# Altium project TMDX654GPEVM.PrjPcb (part 21 of 24)

## Sheet 42-PERIPHERAL POWER SUPPLY.SchDoc
size 513 x 386 mm
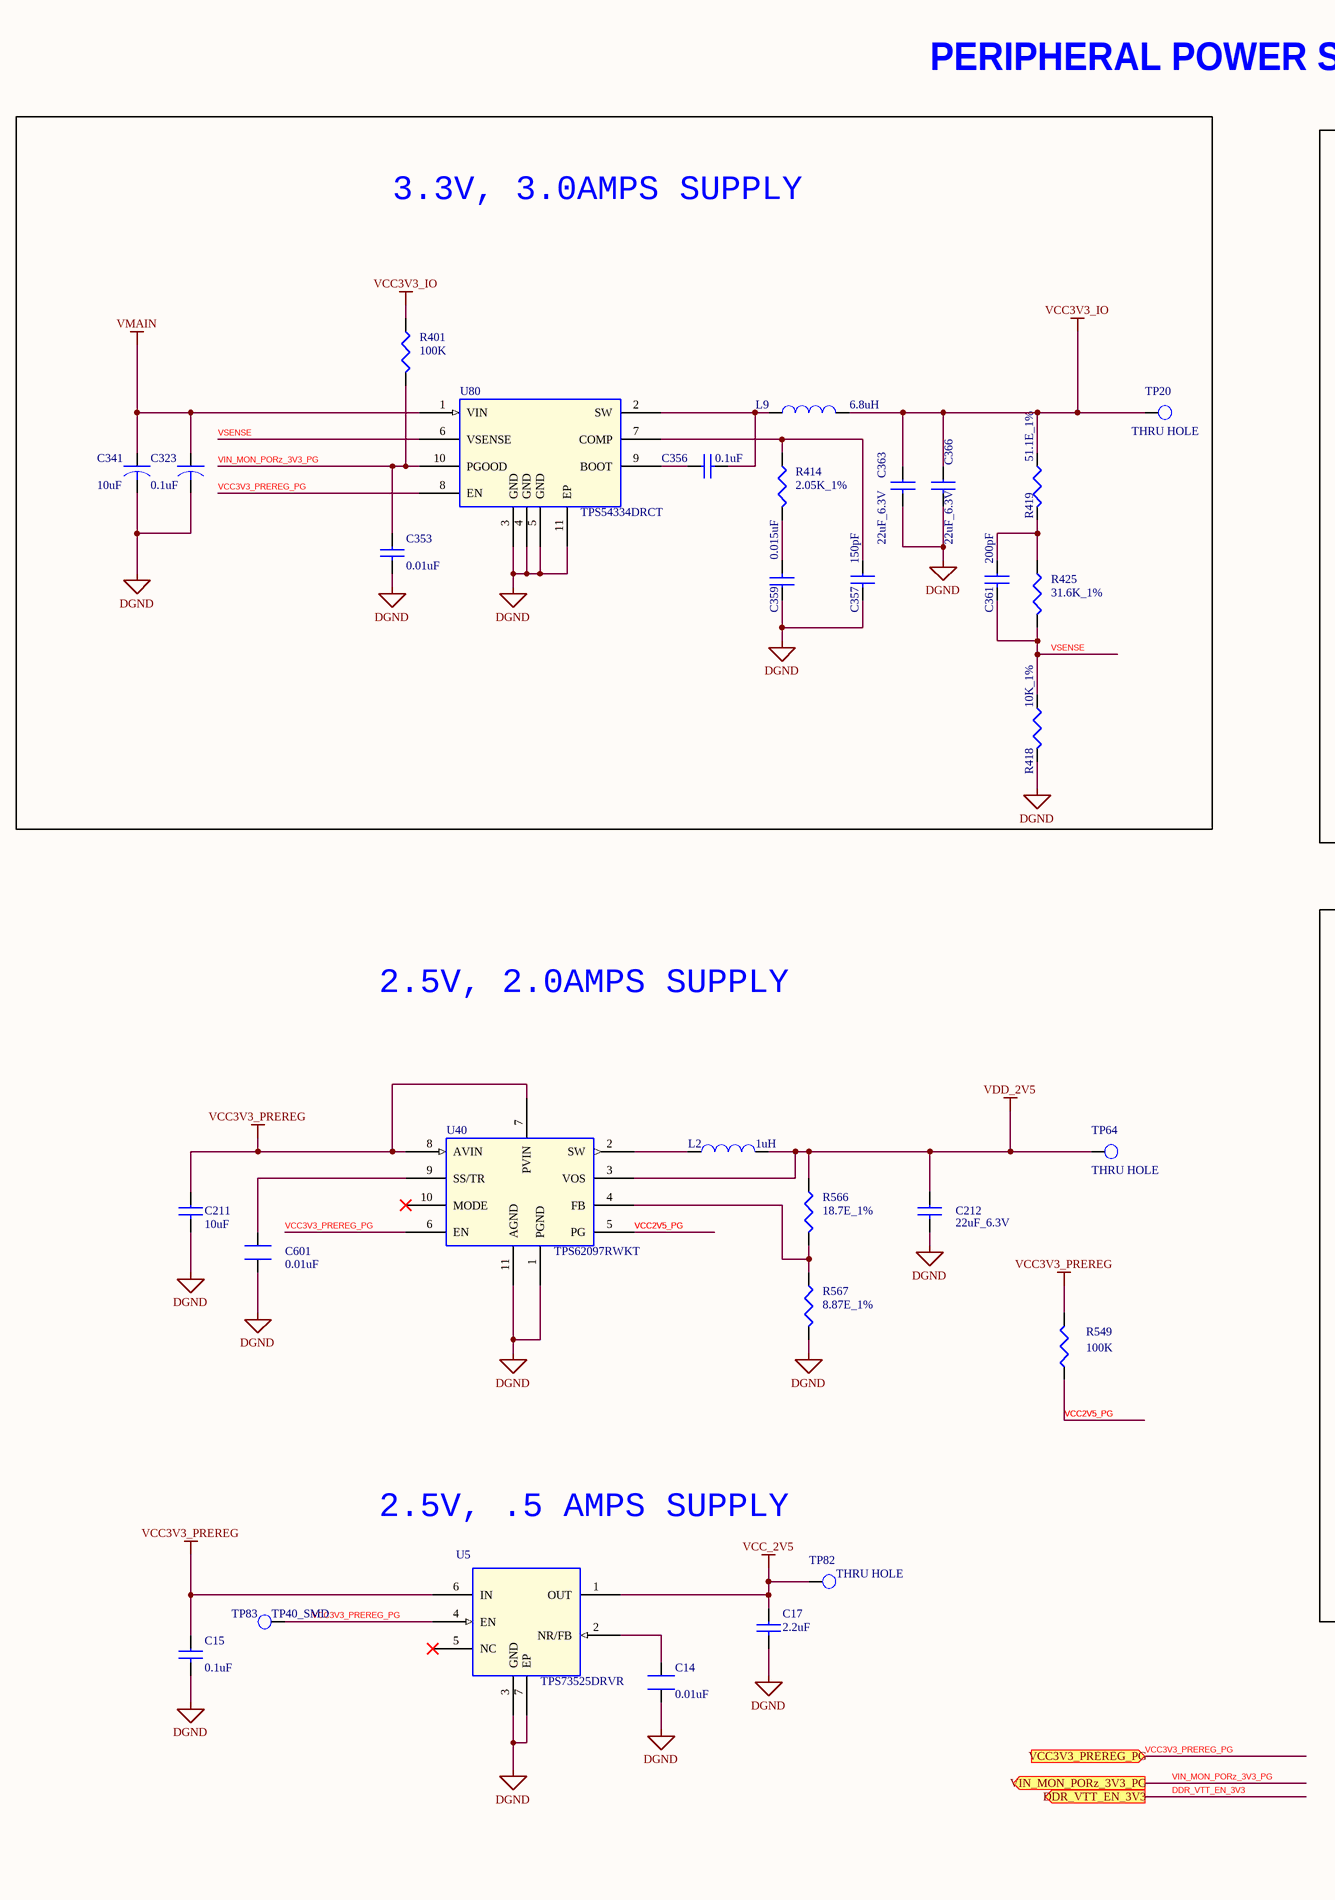
[diagram p78: 42-PERIPHERAL POWER SUPPLY.SchDoc, left]
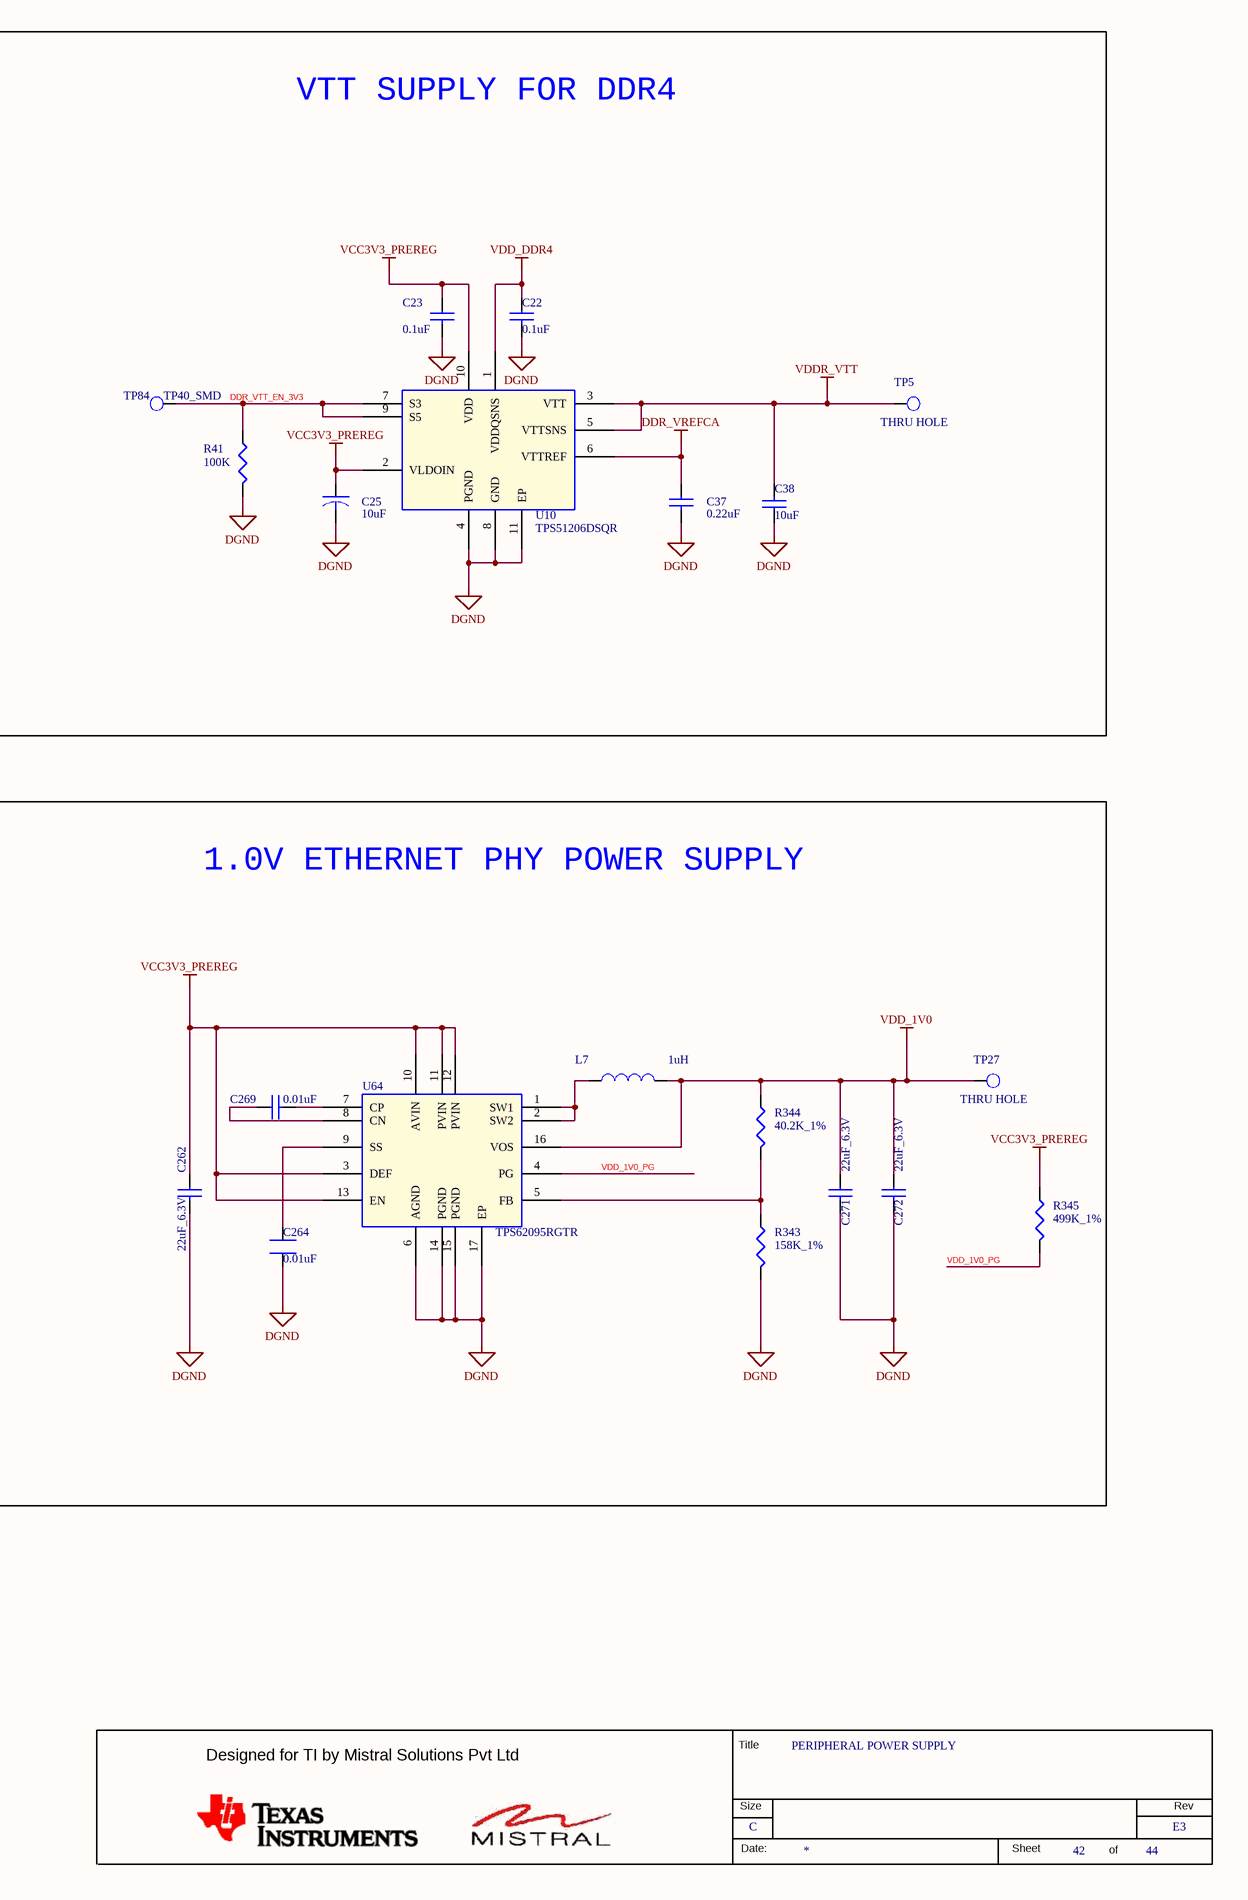
[diagram p79: 42-PERIPHERAL POWER SUPPLY.SchDoc, right]

### Parts
(Parts that share a designator on the sheet are numbered #1, #2 ... from top to bottom, then left to right.)
*#42  RevCode: E3  Title: PERIPHERAL POWER SUPPLY  Page Size: C  Page Number: 42  Page Count: 44  (hidden comment: MISTRAL_TITLEBLK_CSIZE)  (graphical)
C14  0.01uF  [CAP0201_0-5]
C15  0.1uF  [CAP0201_0-5]
C17  2.2uF  [CAP0402_0-75]
C22  0.1uF  [CAP0201_0-5]
C23  0.1uF  [CAP0201_0-5]
C25  10uF  [CAP0603_1]
C37  0.22uF  [CAP0402_0-75]
C38  10uF  [CAP0603_1]
C211  10uF  [CAP0603_1]
C212  22uF_6.3V  [CAP0603]
C262  22uF_6.3V  [CAP0603]
C264  0.01uF  [CAP0201_0-5]
C269  0.01uF  [CAP0201_0-5]
C271  22uF_6.3V  [CAP0603]
C272  22uF_6.3V  [CAP0603]
C323  0.1uF  [CAP0603_1]
C341  10uF  [CAP1206_2]
C353  0.01uF  [CAP0201_0-5]
C356  0.1uF  [CAP0201_0-5]
C357  150pF  [CAP0402_0-75]
C359  0.015uF  [CAP0402]
C361  200pF  [CAP0402_0-75]
C363  22uF_6.3V  [CAP0603]
C366  22uF_6.3V  [CAP0603]
C601  0.01uF  [CAP0201_0-5]
L2  1uH  [IND_IHLP2020AB_210X210_SMD_1-2]
L7  1uH  [IND_XFL4020_170X170_SMD_2-1]
L9  6.8uH  [IND_74439346068_260X270_SMD_6-1]
R41  100K  [RES0402_0-5]
R343  158K_1%  [RES0402_0-5]
R344  40.2K_1%  [RES0402_0-5]
R345  499K_1%  [RES0402]
R401  100K  [RES0402_0-5]
R414  2.05K_1%  [RES0402]
R418  10K_1%  [RES0402_0-5]
R419  51.1E_1%  [RES0402_0-5]
R425  31.6K_1%  [RES0402]
R549  100K  [RES0402_0-5]
R566  18.7E_1%  [RES0402]
R567  8.87E_1%  [RES0402]
TP5  THRU HOLE  [TP_40X65]
TP20  THRU HOLE  [TP_40X65]
TP27  THRU HOLE  [TP_40X65]
TP64  THRU HOLE  [TP_40X65]
TP82  THRU HOLE  [TP_40X65]
TP83  TP40_SMD  [TP40_SMD]
TP84  TP40_SMD  [TP40_SMD]
U5  TPS73525DRVR  [SON6_25-59_85X85_0-8]
U10  TPS51206DSQR  [DFN10_15-74_80X80_0-8]
U40  TPS62097RWKT  [VQFNHR11_TPS62097_80X80_1]
U64  TPS62095RGTR  [QFN16_19-68_120X120_1]
U80  TPS54334DRCT  [SON10_19-68_125X125_1]

### Blocks framed on the sheet
3.3V, 3.0AMPS SUPPLY: C323 C341 C353 C356 C357 C359 C361 C363 C366 L9 R401 R414 R418 R419 R425 TP20 U80
VTT SUPPLY FOR DDR4: C22 C23 C25 C37 C38 R41 TP5 TP84 U10
1.0V ETHERNET PHY POWER SUPPLY: C262 C264 C269 C271 C272 L7 R343-R345 TP27 U64

### Ports
DDR_VTT_EN_3V3 (out), VCC3V3_PREREG_PG (in), VIN_MON_PORz_3V3_PG (out)

### Nets
DDR_VREFCA: C37.1 U10.6(VTTREF)
DGND: C14.2 C15.2 C17.2 C22.2 C23.2 C25.2 C37.2 C38.1 C211.2 C212.2 C262.2 C264.2 C271.2 C272.2 C323.2 C341.2 C353.2 C357.2 C359.1 C363.2 C366.2 C601.2 R41.2 R343.2 R418.2 R567.2 U5.3(GND) U5.7(EP) U10.4(PGND) U10.8(GND) U10.11(EP) U40.1(PGND) U40.11(AGND) U64.6(AGND) U64.14(PGND) U64.15(PGND) U64.17(EP) U80.3(GND) U80.4(GND) U80.5(GND) U80.11(EP)
VCC3V3_IO: C363.1 C366.1 L9.2 R401.1 R419.1 TP20.1(TP)
VCC3V3_PREREG: C15.1 C23.1 C25.1 C211.1 C262.1 R345.1 R549.2 U5.6(IN) U10.2(VLDOIN) U10.10(VDD) U40.7(PVIN) U40.8(AVIN) U64.3(DEF) U64.10(AVIN) U64.11(PVIN) U64.12(PVIN) U64.13(EN)
VCC_2V5: C17.1 TP82.1(TP) U5.1(OUT)
VDD_1V0: C271.1 C272.1 L7.2 R344.1 TP27.1(TP) U64.16(VOS)
VDD_2V5: C212.1 L2.2 R566.1 TP64.1(TP) U40.3(VOS)
VDD_DDR4: C22.1 U10.1(VDDQSNS)
VDDR_VTT: C38.2 TP5.1(TP) U10.3(VTT) U10.5(VTTSNS)
VMAIN: C323.1 C341.1 U80.1(VIN)
DDR_VTT_EN_3V3: R41.1 TP84.1(TP) U10.7(S3) U10.9(S5) ; port DDR_VTT_EN_3V3
VCC2V5_PG: R549.1 U40.5(PG)
VCC3V3_PREREG_PG: TP83.1(TP) U5.4(EN) U40.6(EN) U80.8(EN) ; port VCC3V3_PREREG_PG
VDD_1V0_PG: R345.2 U64.4(PG)
VIN_MON_PORz_3V3_PG: C353.1 R401.2 U80.10(PGOOD) ; port VIN_MON_PORz_3V3_PG
VSENSE: C361.2 R418.1 R425.2 U80.6(VSENSE)
NetC14_1: C14.1 U5.2(NR/FB)
NetC264_1: C264.1 U64.9(SS)
NetC269_1: C269.1 U64.8(CN)
NetC269_2: C269.2 U64.7(CP)
NetC356_1: C356.1 U80.9(BOOT)
NetC356_2: C356.2 L9.1 U80.2(SW)
NetC357_1: C357.1 R414.1 U80.7(COMP)
NetC359_2: C359.2 R414.2
NetC361_1: C361.1 R419.2 R425.1
NetC601_1: C601.1 U40.9(SS/TR)
NetL2_1: L2.1 U40.2(SW)
NetL7_1: L7.1 U64.1(SW1) U64.2(SW2)
NetR343_1: R343.1 R344.2 U64.5(FB)
NetR566_2: R566.2 R567.1 U40.4(FB)

Not connected (* = marked no-connect by the designer): U5 5(NC)*; U40 10(MODE)*

### Notes on the sheet
- PERIPHERAL POWER SUPPLY
- 2.5V, 2.0AMPS SUPPLY
- 2.5V, .5 AMPS SUPPLY
- (in symbol MISTRAL_TITLEBLK_CSIZE) Title; Designed for TI by Mistral Solutions Pvt Ltd; Size; Rev; Date:; Sheet; of

### Library data of the parts
*#42 = MISTRAL_TITLEBLK_CSIZE: Issue: 1.0; Page Create Date: March  8, 1995; Page Modify Date: *
C14 = CAP_Dup3: CAP CERAMIC 0.01uF 25V 10% X5R 0201; Part_type: CAPACITORS\CERAMIC; Mfr_part_number: GRM033R61E103KA12J; Mfr_name: MURATA; Mistral Part No: 120018010007-R; Custom_Duty: 15%; Customs_HS_Code: 85322990; Project: TI_MAXIE_CPB; Wattage: NA; NI_MARK: DNI; Library Ref: CAP; PCB Footprint: CAP0201_0-5; Chkd/date: MANIRAJA/230118; Crtd /date: MANIRAJA/230118; Datasheet: Y:\MIS_DATABASE\DATASHEETS\CAPACITORS\GRM033R61E103KA12.PDF; Height: 0.33MM; Distributor_part_number: GRM033R61E103KA12J-ND; Distributor_name: DIGIKEY; Package: 0201; Voltage: 25V; Tolerance: 10%; Weight: 0.33mg; Temperature: -55°C+85°C; MECHANICAL 3D STEP FILE: CAP0201_0-5
C15 C356 = CAP_Dup5: as C266 on sheet 41-SoC POWER SUPPLY; Library Ref: CAP; Tolerance: 10%; Voltage: 16V; Package: 0201; Distributor_name: DIGIKEY; Distributor_part_number: 490-16742-1-ND; Height: 0.33MM; Weight: 0.33mg; Temperature: -55°C+85°C; Datasheet: Y:\MIS_DATABASE\DATASHEETS\CAPACITORS\GRM033R61C104KE84.PDF; Crtd /date: MANIRAJA/120218; Chkd/date: MANIRAJA/120218; MECHANICAL 3D STEP FILE: CAP0201_0-5; PCB Footprint: CAP0201_0-5
C17 = CAP_Dup5: CAP CERAMIC 2.2uF 10V 20% X5R 0402; Mistral Part No: 120018010016-R; Mfr_name: MURATA; Mfr_part_number: GRT155R61A225ME01D; Part_type: CAPACITORS\CERAMIC; Project: TI_MAXIE_CPB; Wattage: NA; Customs_HS_Code: 85322990; Custom_Duty: 15%; Library Ref: CAP; PCB Footprint: CAP0402_0-75; Tolerance: 20%; Voltage: 10V; Package: 0402; Distributor_name: DIGIKEY; Distributor_part_number: 490-12254-1-ND; Height: 0.55MM; Weight: 0.65mg; Temperature: -55°C+85°C; Datasheet: Y:\MIS_DATABASE\DATASHEETS\CAPACITORS\GRT155R61A225ME01.PDF; Crtd /date: MANIRAJA/240118; Chkd/date: MANIRAJA/240118; MECHANICAL 3D STEP FILE: CAP0402_0-75
C22 C23 = CAP_Dup5: as C252 on sheet 41-SoC POWER SUPPLY; Library Ref: CAP; MECHANICAL 3D STEP FILE: CAP0201_0-5; Chkd/date: MANIRAJA/120218; Crtd /date: MANIRAJA/120218; Datasheet: Y:\MIS_DATABASE\DATASHEETS\CAPACITORS\GRM033R61C104KE84.PDF; Temperature: -55°C+85°C; Weight: 0.33mg; Height: 0.33MM; Distributor_part_number: 490-16742-1-ND; Distributor_name: DIGIKEY; Package: 0201; Voltage: 16V; Tolerance: 10%; PCB Footprint: CAP0201_0-5
C25 = CAP: CAP CERAMIC 10uF 10V 10% X5R 0603; Mistral Part No: 120010080001-R; Mfr_name: AVX CORPORATION; Mfr_part_number: 0603ZD106KAT2A; Part_type: CAPACITORS\CERAMIC; Project: TI_MAXIE_CPB; Wattage: NA; Customs_HS_Code: 85322990; Custom_Duty: 15%; Library Ref: CAP; MECHANICAL 3D STEP FILE: CAP0603_1; PCB Footprint: CAP0603_1; Tolerance: 10%; Voltage: 10V; Package: 0603; Distributor_name: DIGIKEY; Distributor_part_number: 478-10766-1-ND; Height: 0.94MM; Weight: 2mg; Temperature: -55°C+85°C; Datasheet: Y:\MIS_DATABASE\DATASHEETS\CAPACITORS\AVX_MLC.PDF; Crtd /date: MANIRAJA/230118; Chkd/date: MANIRAJA/230118
C37 = CAP_Dup5: CAP CERAMIC 0.22uF 10V 10% X5R 0402; Mistral Part No: 120009030090-R; Mfr_name: MURATA; Mfr_part_number: GRM155R61A224KE19D; Part_type: CAPACITORS\CERAMIC; Project: SMART VIEW_NVR; Wattage: NA; Customs_HS_Code: 85322990; Custom_Duty: 15%; Library Ref: CAP; Tolerance: 10%; Voltage: 10V; Package: 0402; Distributor_name: DIGIKEY; Distributor_part_number: 490-3910-1-ND; Height: 0.55MM; Weight: 6mg; Temperature: -55°C+85°C; Datasheet: Y:\MIS_DATABASE\DATASHEETS\CAPACITORS\GRM188SERIES.PDF; Crtd /date: MAZHAR/170907; Chkd/date: VASANTHA/291216; MECHANICAL 3D STEP FILE: CAP0402_0-75; PCB Footprint: CAP0402_0-75
C38 = CAP_Dup5: CAP CERAMIC 10uF 10V 10% X5R 0603; Mistral Part No: 120010080001-R; Mfr_name: AVX CORPORATION; Mfr_part_number: 0603ZD106KAT2A; Part_type: CAPACITORS\CERAMIC; Wattage: NA; Project: TI_MAXIE_CPB; Customs_HS_Code: 85322990; Custom_Duty: 15%; Library Ref: CAP; MECHANICAL 3D STEP FILE: CAP0603_1; Temperature: -55°C+85°C; Weight: 2mg; Tolerance: 10%; Voltage: 10V; Package: 0603; Distributor_name: DIGIKEY; Distributor_part_number: 478-10766-1-ND; Height: 0.94MM; Datasheet: Y:\MIS_DATABASE\DATASHEETS\CAPACITORS\AVX_MLC.PDF; Crtd /date: MANIRAJA/230118; Chkd/date: MANIRAJA/230118; PCB Footprint: CAP0603_1
C211 = CAP_Dup5: as C260 on sheet 41-SoC POWER SUPPLY; Library Ref: CAP; PCB Footprint: CAP0603_1; Tolerance: 10%; Voltage: 10V; Package: 0603; Distributor_name: DIGIKEY; Distributor_part_number: 478-10766-1-ND; Height: 0.94MM; Weight: 2mg; Temperature: -55°C+85°C; Datasheet: Y:\MIS_DATABASE\DATASHEETS\CAPACITORS\AVX_MLC.PDF; Crtd /date: MANIRAJA/230118; Chkd/date: MANIRAJA/230118; MECHANICAL 3D STEP FILE: CAP0603_1
C212 C271 = CAP_Dup5: as C605 on sheet 41-SoC POWER SUPPLY; Library Ref: CAP; Tolerance: 20%; Voltage: 6.3V; Package: 0603; Distributor_name: DIGIKEY; Distributor_part_number: 490-7611-2-ND; Height: 1.00MM; Weight: NA; Temperature: -55°C+85°C; Datasheet: Y:\MIS_DATABASE\DATASHEETS\CAPACITORS\GRM188SERIES.PDF; Crtd /date: JEBRAN/090915; Chkd/date: JEBRAN/090915; Distributor_name_A: DIGIKEY; Distributor_part_number_A: 311-1815-1-ND; PCB Footprint: CAP0603
C262 C272 = CAP_Dup5: as C267 on sheet 41-SoC POWER SUPPLY; Library Ref: CAP; Chkd/date: JEBRAN/090915; Crtd /date: JEBRAN/090915; Datasheet: Y:\MIS_DATABASE\DATASHEETS\CAPACITORS\GRM188SERIES.PDF; Temperature: -55°C+85°C; Weight: NA; Height: 1.00MM; Distributor_part_number: 490-7611-2-ND; Distributor_name: DIGIKEY; Package: 0603; Voltage: 6.3V; Tolerance: 20%; Distributor_name_A: DIGIKEY; Distributor_part_number_A: 311-1815-1-ND; PCB Footprint: CAP0603
C264 = CAP_Dup3: CAP CERAMIC 0.01uF 25V 10% X5R 0201; Mistral Part No: 120018010007-R; Mfr_name: MURATA; Mfr_part_number: GRM033R61E103KA12J; Part_type: CAPACITORS\CERAMIC; Wattage: NA; Project: TI_MAXIE_CPB; Customs_HS_Code: 85322990; Custom_Duty: 15%; Library Ref: CAP; PCB Footprint: CAP0201_0-5; MECHANICAL 3D STEP FILE: CAP0201_0-5; Temperature: -55°C+85°C; Weight: 0.33mg; Tolerance: 10%; Voltage: 25V; Package: 0201; Distributor_name: DIGIKEY; Distributor_part_number: GRM033R61E103KA12J-ND; Height: 0.33MM; Datasheet: Y:\MIS_DATABASE\DATASHEETS\CAPACITORS\GRM033R61E103KA12.PDF; Crtd /date: MANIRAJA/230118; Chkd/date: MANIRAJA/230118
C269 = CAP_Dup4: CAP CERAMIC 0.01uF 25V 10% X5R 0201; Mistral Part No: 120018010007-R; Mfr_name: MURATA; Mfr_part_number: GRM033R61E103KA12J; Part_type: CAPACITORS\CERAMIC; Wattage: NA; Project: TI_MAXIE_CPB; Customs_HS_Code: 85322990; Custom_Duty: 15%; Library Ref: CAP; PCB Footprint: CAP0201_0-5; MECHANICAL 3D STEP FILE: CAP0201_0-5; Tolerance: 10%; Voltage: 25V; Package: 0201; Distributor_name: DIGIKEY; Distributor_part_number: GRM033R61E103KA12J-ND; Height: 0.33MM; Weight: 0.33mg; Temperature: -55°C+85°C; Datasheet: Y:\MIS_DATABASE\DATASHEETS\CAPACITORS\GRM033R61E103KA12.PDF; Crtd /date: MANIRAJA/230118; Chkd/date: MANIRAJA/230118
C323 = CAP_Dup1: CAP CERAMIC 0.1uF 50V 20% X7R 0603; Part_type: CAPACITORS\CERAMIC; Mfr_part_number: C0603C104M5RACTU; Mfr_name: KEMET; Mistral Part No: 120018010021-R; Custom_Duty: 15%; Customs_HS_Code: 85322990; Wattage: NA; Project: TI_MAXIE_CPB; Library Ref: CAP; PCB Footprint: CAP0603_1; Chkd/date: MANIRAJA/240118; Crtd /date: MANIRAJA/240118; Datasheet: Y:\MIS_DATABASE\DATASHEETS\CAPACITORS\KEMET-X7R-SER.PDF; Temperature: -55°C+125°C; Weight: 2mg; Height: 0.95MM; Distributor_part_number: 399-7845-1-ND; Distributor_name: DIGIKEY; Package: 0603; Voltage: 50V; Tolerance: 20%; MECHANICAL 3D STEP FILE: CAP0603_1
C341 = CAP: as C255 on sheet 41-SoC POWER SUPPLY; Footprint Ref: CAP1206_2; Library Ref: CAP; MECHANICAL 3D STEP FILE: CAP1206_2; PCB Footprint: CAP1206_2; Chkd/date: MANIRAJA/240118; Crtd /date: MANIRAJA/240118; Datasheet: Y:\MIS_DATABASE\DATASHEETS\CAPACITORS\GRM31CR61H106MA12.PDF; Temperature: -55°C+85°C; Weight: 40mg; Height: 1.80MM; Distributor_part_number: 490-10756-1-ND; Distributor_name: DIGIKEY; Package: 1206; Voltage: 50V; Tolerance: 20%; Library Path: Y:\MIS_DATABASE\Library\ALTIUM_TOOL\SCHEMATICS_PARTS\MS_DISCRETE_Library.schlib; Footprint Path: Y:\MIS_DATABASE\Library\ALTIUM_TOOL\PCB_FOOTPRINTS\Altium_Footprint_Lib.PcbLib
C353 = CAP_Dup5: CAP CERAMIC 0.01uF 25V 10% X5R 0201; Part_type: CAPACITORS\CERAMIC; Mfr_part_number: GRM033R61E103KA12J; Mfr_name: MURATA; Mistral Part No: 120018010007-R; Custom_Duty: 15%; Customs_HS_Code: 85322990; Project: TI_MAXIE_CPB; Wattage: NA; NI_MARK: DNI; Library Ref: CAP; PCB Footprint: CAP0201_0-5; Chkd/date: MANIRAJA/230118; Crtd /date: MANIRAJA/230118; Datasheet: Y:\MIS_DATABASE\DATASHEETS\CAPACITORS\GRM033R61E103KA12.PDF; Height: 0.33MM; Distributor_part_number: GRM033R61E103KA12J-ND; Distributor_name: DIGIKEY; Package: 0201; Voltage: 25V; Tolerance: 10%; Weight: 0.33mg; Temperature: -55°C+85°C; MECHANICAL 3D STEP FILE: CAP0201_0-5
C357 = CAP_Dup5: CAP CERAMIC 150pF 50V 10% X7R 0402; Mistral Part No: 120018010022-R; Mfr_name: WURTH ELECTRONICS; Mfr_part_number: 885012205056; Part_type: CAPACITORS\CERAMIC; Project: TI_MAXIE_CPB; Wattage: NA; Customs_HS_Code: 85322990; Custom_Duty: 15%; Library Ref: CAP; PCB Footprint: CAP0402_0-75; Tolerance: 10%; Voltage: 50V; Package: 0402; Distributor_name: DIGIKEY; Distributor_part_number: 732-7551-1-ND; Height: 0.55MM; Weight: 0.65mg; Temperature: -55°C+125°C; Datasheet: Y:\MIS_DATABASE\DATASHEETS\CAPACITORS\'885012205056.PDF; Crtd /date: MANIRAJA/240118; Chkd/date: MANIRAJA/240118; MECHANICAL 3D STEP FILE: CAP0402_0-75
C359 = CAP_Dup5: CAP CERAMIC 0.015uF 16V 10% X7R 0402; Mistral Part No: 120015120015-R; Mfr_name: MURATA; Mfr_part_number: GRM155R71C153KA01J; Part_type: CAPACITORS\CERAMIC; Alternate_mfr_part_number_A: GRM155R71C153KA01D; Project: DLRL_NBSDR; Wattage: NA; Customs_HS_Code: 85322990; Custom_Duty: 15%; Library Ref: CAP; Tolerance: 10%; Voltage: 16V; Package: 0402; Distributor_name: DIGIKEY; Distributor_part_number: 490-6329-1-ND; Alternate_mfr_name_A: MURATA; Distributor_name_A: DIGIKEY; Distributor_part_number_A: 490-1314-1-ND; Height: 0.55MM; Weight: NA; Temperature: -55°C+125°C; Datasheet: Y:\MIS_DATABASE\DATASHEETS\CAPACITORS\GRM188SERIES.PDF; Crtd /date: VASANTHA/211215; Chkd/date: VASANTHA/211215; PCB Footprint: CAP0402
C361 = CAP_Dup5: CAP CERAMIC 200pF 50V 5% C0G 0402; Part_type: CAPACITORS\CERAMIC; Mfr_part_number: GRM1555C1H201JA01D; Mfr_name: MURATA; Mistral Part No: 120009090005-R; Custom_Duty: 15%; Customs_HS_Code: 85322990; Wattage: NA; Project: GOLDEN-I; Library Ref: CAP; MECHANICAL 3D STEP FILE: CAP0402_0-75; Chkd/date: MANIRAJA/130617; Crtd /date: MAZHAR/090909; Datasheet: Y:\MIS_DATABASE\DATASHEETS\CAPACITORS\MURATA_CMCC.PDF; Temperature: -55°C+125°C; Weight: 6mg; Height: 0.55MM; Distributor_part_number: 490-3232-1-ND; Distributor_name: DIGIKEY; Package: 0402; Voltage: 50V; Tolerance: 5%; PCB Footprint: CAP0402_0-75
C363 C366 = CAP_Dup5: CAP CERAMIC 22uF 6.3V 20% X5R 0603; Alternate_mfr_part_number_A: CC0603MRX5R5BB226; Alternate_mfr_name_A: YAGEO AMERICA; Part_type: CAPACITORS\CERAMIC; Mfr_part_number: GRM188R60J226MEA0; Mfr_name: MURATA; Mistral Part No: 120015090007-R; Custom_Duty: 15%; Customs_HS_Code: 85322990; Wattage: NA; Project: OCTBTS_3000; PCB Footprint: CAP0603; Distributor_part_number_A: 311-1815-1-ND; Distributor_name_A: DIGIKEY; Chkd/date: JEBRAN/090915; Crtd /date: JEBRAN/090915; Datasheet: Y:\MIS_DATABASE\DATASHEETS\CAPACITORS\GRM188SERIES.PDF; Temperature: -55°C+85°C; Weight: NA; Height: 1.00MM; Distributor_part_number: 490-7611-2-ND; Distributor_name: DIGIKEY; Package: 0603; Voltage: 6.3V; Tolerance: 20%; Library Ref: CAP
C601 = CAP_Dup3: as C3 on sheet 41-SoC POWER SUPPLY; Library Ref: CAP; Chkd/date: MANIRAJA/230118; Crtd /date: MANIRAJA/230118; Datasheet: Y:\MIS_DATABASE\DATASHEETS\CAPACITORS\GRM033R61E103KA12.PDF; Height: 0.33MM; Distributor_part_number: GRM033R61E103KA12J-ND; Distributor_name: DIGIKEY; Package: 0201; Voltage: 25V; Tolerance: 10%; Weight: 0.33mg; Temperature: -55°C+85°C; MECHANICAL 3D STEP FILE: CAP0201_0-5; PCB Footprint: CAP0201_0-5
L2 = INDUCTOR: IND POWER 1uH 4.4A 20% SMD; Mistral Part No: 130017030015-R; Mfr_name: VISHAY; Mfr_part_number: IHLP2020ABER1R0M01; Project: ADA_3U_FMC; Voltage: NA; Customs_HS_Code: 85437099; Custom_Duty: 24%; Library Ref: INDUCTOR; Part_type: INDUCTOR; Tolerance: 20%; Wattage: NA; Package: SMD; Distributor_name: DIGIKEY; Distributor_part_number: 541-1704-1-ND; Height: 1.20MM; Weight: 200mg; Temperature: -55°C+125°C; Datasheet: Y:\MIS_DATABASE\DATASHEETS\DISCRETES\INDUCTORS\IHLP2020AB.PDF; Crtd /date: MANIRAJA/160317; Chkd/date: VASANTHA/170317; MECHANICAL 3D STEP FILE: IND_IHLP2020AB_210X210_SMD_1-2; PCB Footprint: IND_IHLP2020AB_210X210_SMD_1-2
L7 = INDUCTOR: IND POWER 1uH 8A 20% SMD; Mfr_part_number: XFL4020-102MEC; Mfr_name: COIL CRAFT; Mistral Part No: 130012030053-R; Custom_Duty: 24%; Customs_HS_Code: 85437099; Wattage: NA; Project: IRIS; Library Ref: INDUCTOR; PCB Footprint: IND_XFL4020_170X170_SMD_2-1; MECHANICAL 3D STEP FILE: IND_XFL4020_170X170_SMD_2-1; Chkd/date: VASANTHA/050117; Crtd /date: CHAITHANYA/290312; Datasheet: Y:\MIS_DATABASE\DATASHEETS\DISCRETES\INDUCTORS\XFL4020.PDF; Temperature: -40°C+85°C; Weight: 169mg; Height: 2.10MM; Distributor_part_number: 994-XFL4020-102MEC; Distributor_name: MOUSER; Package: SMD; Voltage: NA; Tolerance: 20%; Part_type: INDUCTOR
L9 = INDUCTOR: IND POWER 6.8uH 6.5A 20% SMD; Mfr_part_number: 74439346068; Mfr_name: WURTH ELECTRONICS; Mistral Part No: 130017100019-R; Custom_Duty: 24%; Customs_HS_Code: 85437099; Wattage: NA; Project: TI_MAXIE_CPB; Library Ref: INDUCTOR; MECHANICAL 3D STEP FILE: IND_74439346068_260X270_SMD_6-1; Chkd/date: MANIRAJA/171017; Crtd /date: MANIRAJA/171017; Datasheet: Y:\MIS_DATABASE\DATASHEETS\DISCRETES\INDUCTORS\74439346068.PDF; Temperature: -40°C+125°C; Weight: NA; Height: 6.10MM; Distributor_part_number: 732-10705-1-ND; Distributor_name: DIGIKEY; Package: SMD; Voltage: NA; Tolerance: 20%; Part_type: INDUCTOR; PCB Footprint: IND_74439346068_260X270_SMD_6-1
R41 = RESISTOR_Dup4: RES 100K 1/16W 5% 0402; Mistral Part No: 110011060002-R; Mfr_name: VISHAY; Mfr_part_number: CRCW0402100KJNED; Part_type: RESISTORS\FIXED; Project: AM4515_EVM_LCD; Voltage: NA; Customs_HS_Code: 85332119; Custom_Duty: 15%; Library Ref: RESISTOR; MECHANICAL 3D STEP FILE: RES0402_0-5; PCB Footprint: RES0402_0-5; Tolerance: 5%; Wattage: 1/16W; Package: 0402; Distributor_name: DIGIKEY; Distributor_part_number: 541-100KJCT-ND; Height: 0.40MM; Weight: 0.65mg; Temperature: -55°C+155°C; Datasheet: Y:\MIS_DATABASE\DATASHEETS\RESISTORS\CRCW0603.PDF; Crtd /date: BAVISH/010611; Chkd/date: VASANTHA/061216
R343 = RESISTOR_Dup5: RES 158K 1/16W 1% 0402; Part_type: RESISTORS\FIXED; Mfr_part_number: RC0402FR-07158KL; Mfr_name: YAGEO AMERICA; Mistral Part No: 110017100001-R; Custom_Duty: 15%; Customs_HS_Code: 85332119; Voltage: NA; Project: TI_MAXIE_CPB; Library Ref: RESISTOR; Chkd/date: MANIRAJA/031017; Crtd /date: MANIRAJA/031017; Datasheet: Y:\MIS_DATABASE\DATASHEETS\RESISTORS\YAGEO-RC0402.PDF; Temperature: -55°C+155°C; Weight: 0.65mg; Height: 0.40MM; Distributor_part_number: YAG2990CT-ND; Distributor_name: DIGIKEY; Package: 0402; Wattage: 1/16W; Tolerance: 1%; MECHANICAL 3D STEP FILE: RES0402_0-5; PCB Footprint: RES0402_0-5
R344 = RESISTOR_Dup5: as R339 on sheet 41-SoC POWER SUPPLY; Footprint Path: Y:\MIS_DATABASE\Library\ALTIUM_TOOL\PCB_FOOTPRINTS\Altium_Footprint_Lib.PcbLib; Library Path: Y:\MIS_DATABASE\Library\ALTIUM_TOOL\SCHEMATICS_PARTS\MS_DISCRETE_Library.schlib; Footprint Ref: RES0402_0-5; Library Ref: RESISTOR; Tolerance: 1%; Wattage: 1/16W; Package: 0402; Distributor_name: DIGIKEY; Distributor_part_number: 311-40.2KLRDKR-ND; Height: 0.40MM; Weight: 0.65mg; Temperature: -55°C+155°C; Datasheet: Y:\MIS_DATABASE\DATASHEETS\RESISTORS\YAGEO_RES.PDF; Crtd /date: MAZHAR/170505; Chkd/date: VASANTHA/291216; MECHANICAL 3D STEP FILE: RES0402_0-5; PCB Footprint: RES0402_0-5
R345 = RESISTOR_Dup5: RES 499K 1/16W 1% 0402; Mistral Part No: 110009090015-P; Mfr_name: YAGEO AMERICA; Mfr_part_number: RC0402FR-07499KL; Part_type: RESISTORS\FIXED; Project: GOLDEN-I; Voltage: 50V; Customs_HS_Code: 85332119; Custom_Duty: 15%; Library Ref: RESISTOR; PCB Footprint: RES0402; Tolerance: 1%; Wattage: 1/16W; Package: 0402; Distributor_name: DIGIKEY; Distributor_part_number: 311-499KLRCT-ND; Height: 0.40MM; Weight: 0.8g/1000pcs; Temperature: -55°C+155°C; Datasheet: Y:\MIS_DATABASE\DATASHEETS\RESISTORS\YAGEO-RC0402.PDF; Crtd /date: MAZHAR/240909; Chkd/date: SUHAS/290910; RoHS: Pb-Free
R401 = RESISTOR_Dup5: RES 100K 1/16W 5% 0402; Mistral Part No: 110011060002-R; Mfr_name: VISHAY; Mfr_part_number: CRCW0402100KJNED; Part_type: RESISTORS\FIXED; Project: AM4515_EVM_LCD; Voltage: NA; Customs_HS_Code: 85332119; Custom_Duty: 15%; Library Ref: RESISTOR; Tolerance: 5%; Wattage: 1/16W; Package: 0402; Distributor_name: DIGIKEY; Distributor_part_number: 541-100KJCT-ND; Height: 0.40MM; Weight: 0.65mg; Temperature: -55°C+155°C; Datasheet: Y:\MIS_DATABASE\DATASHEETS\RESISTORS\CRCW0603.PDF; Crtd /date: BAVISH/010611; Chkd/date: VASANTHA/061216; MECHANICAL 3D STEP FILE: RES0402_0-5; PCB Footprint: RES0402_0-5
R414 = RESISTOR_Dup5: RES 2.05K 1/10W 1% 0402; Part_type: RESISTORS\FIXED; Mfr_part_number: ERJ-2RKF2051X; Mfr_name: PANASONIC; Mistral Part No: 110014110019-R; Custom_Duty: 15%; Customs_HS_Code: 85332119; Voltage: NA; Project: ZK BIOMETRIC; Library Ref: RESISTOR; Chkd/date: NAVEED/261214; Crtd /date: JEBRAN/271114; Datasheet: Y:\MIS_DATABASE\DATASHEETS\RESISTORS\ERJ-2R.PDF; Temperature: -55°C+125°C; Weight: NA; Height: 0.40MM; Distributor_part_number: P2.05KLCT-ND; Distributor_name: DIGIKEY; Package: 0402; Wattage: 1/10W; Tolerance: 1%; PCB Footprint: RES0402
R418 = RESISTOR_Dup5: RES 10K 1/16W 1% 0402; Part_type: RESISTORS\FIXED; Mfr_part_number: RC0402FR-0710KL; Mfr_name: YAGEO AMERICA; Mistral Part No: 110009030220-P; Custom_Duty: 15%; Customs_HS_Code: 85332119; Voltage: NA; Project: VOCERA; Footprint Path: Y:\MIS_DATABASE\Library\ALTIUM_TOOL\PCB_FOOTPRINTS\Altium_Footprint_Lib.PcbLib; Library Path: Y:\MIS_DATABASE\Library\ALTIUM_TOOL\SCHEMATICS_PARTS\MS_DISCRETE_Library.schlib; Footprint Ref: RES0402_0-5; Library Ref: RESISTOR; MECHANICAL 3D STEP FILE: RES0402_0-5; RoHS: Pb-Free; Chkd/date: VASANTHA/201216; Crtd /date: GEETHA/290506; Datasheet: Y:\MIS_DATABASE\DATASHEETS\RESISTORS\YAGEO-RC0402.PDF; Temperature: -55°C+155°C; Weight: 0.65mg; Height: 0.40MM; Distributor_part_number: 311-10.0KLRTR-ND; Distributor_name: DIGIKEY; Package: 0402; Wattage: 1/16W; Tolerance: 1%; PCB Footprint: RES0402_0-5
R419 = RESISTOR_Dup5: RES 51.1E 1/16W 1% 0402; Mistral Part No: 110017060001-R; Mfr_name: YAGEO AMERICA; Mfr_part_number: RC0402FR-0751R1L; Part_type: RESISTORS\FIXED; Project: TI_SVB_CONTROLLER CARD; Voltage: NA; Customs_HS_Code: 85332119; Custom_Duty: 15%; Library Ref: RESISTOR; Tolerance: 1%; Wattage: 1/16W; Package: 0402; Distributor_name: DIGIKEY; Distributor_part_number: 311-51.1LRCT-ND; Height: 0.40MM; Weight: 0.65mg; Temperature: -55°C+155°C; Datasheet: Y:\MIS_DATABASE\DATASHEETS\RESISTORS\YAGEO-RC0402.PDF; Crtd /date: MANIRAJA/280617; Chkd/date: MANIRAJA/280617; MECHANICAL 3D STEP FILE: RES0402_0-5; PCB Footprint: RES0402_0-5
R425 = RESISTOR_Dup5: RES 31.6K 1/10W 1% 0402; Mistral Part No: 110009030679-R; Mfr_name: PANASONIC-ECG; Mfr_part_number: ERJ-2RKF3162X; Part_type: RESISTORS\FIXED; Project: VOCERA; Customs_HS_Code: 85332119; Custom_Duty: 15%; Footprint Path: Y:\MIS_DATABASE\Library\ALTIUM_TOOL\PCB_FOOTPRINTS\Altium_Footprint_Lib.PcbLib; Library Path: Y:\MIS_DATABASE\Library\ALTIUM_TOOL\SCHEMATICS_PARTS\MS_DISCRETE_Library.schlib; Footprint Ref: RES0402; Library Ref: RESISTOR; PCB Footprint: RES0402; Tolerance: 1%; Wattage: 1/10W; Package: 0402; Distributor_name: DIGIKEY; Distributor_part_number: P31.6KLCT-ND; Height: 0.40MM; Datasheet: Y:\MIS_DATABASE\DATASHEETS\RESISTORS\PAN_ERJ.PDF; Crtd /date: SHREESHAIL/070606; Chkd/date: SHREESHAIL/070606
R549 = RESISTOR_Dup5: as R12 on sheet 41-SoC POWER SUPPLY; Library Ref: RESISTOR; PCB Footprint: RES0402_0-5; MECHANICAL 3D STEP FILE: RES0402_0-5; Chkd/date: VASANTHA/061216; Crtd /date: BAVISH/010611; Datasheet: Y:\MIS_DATABASE\DATASHEETS\RESISTORS\CRCW0603.PDF; Temperature: -55°C+155°C; Weight: 0.65mg; Height: 0.40MM; Distributor_part_number: 541-100KJCT-ND; Distributor_name: DIGIKEY; Package: 0402; Wattage: 1/16W; Tolerance: 5%
R566 = RESISTOR_Dup5: RES 18.7E 1/16W 1% 0402; Mistral Part No: 110010090023-P; Mfr_name: VISHAY; Mfr_part_number: CRCW040218R7FKED; Part_type: RESISTORS\FIXED; Project: ITS; Voltage: 50V; Customs_HS_Code: 85332119; Custom_Duty: 15%; Library Ref: RESISTOR; Tolerance: 1%; Wattage: 1/16W; Package: 0402; Distributor_name: DIGIKEY; Distributor_part_number: 541-18.7LCT-ND; Height: 0.40MM; Weight: 0.65g/1000pcs; Temperature: -55°C+125°C; Datasheet: Y:\MIS_DATABASE\DATASHEETS\RESISTORS\CRCW0603.PDF; Crtd /date: MUDDU/080910; Chkd/date: SUHAS/230910; RoHS: Pb-Free; PCB Footprint: RES0402
R567 = RESISTOR_Dup5: RES 8.87E 1/16W 1% 0402; Mistral Part No: 110014010002-R; Mfr_name: VISHAY; Mfr_part_number: CRCW04028R87FKED; Part_type: RESISTORS\FIXED; Project: ITS2_CC; Voltage: NA; Customs_HS_Code: 85332119; Custom_Duty: 15%; Library Ref: RESISTOR; Tolerance: 1%; Wattage: 1/16W; Package: 0402; Distributor_name: DIGIKEY; Distributor_part_number: 541-8.87LLCT-ND; Height: 0.40MM; Weight: 0.65mg; Temperature: -55°C+155°C; Datasheet: Y:\MIS_DATABASE\DATASHEETS\RESISTORS\CRCW0603.PDF; Crtd /date: JAGADISH/090114; Chkd/date: USMAN/100114; PCB Footprint: RES0402
TP5 TP20 TP27 TP82 = TESTPOINT: TESTPOINT 1.0MM DRILL PTH; Part_type: MISC\TESTPOINT; Mfr_name: LOCAL; Mistral Part No: 130009030938; Project: HSE; NI_MARK: DNI; Library Ref: TESTPOINT; PCB Footprint: TP_40X65; Chkd/date: MAZHAR/271211; Crtd /date: SHREESHAIL/041005; Datasheet: NA; Height: NA; Distributor_part_number: NA; Distributor_name: NA; Package: THRU-HOLE; Mfr_part_number: TP_40X65
TP64 = TESTPOINT: as TP19 on sheet 41-SoC POWER SUPPLY; Library Ref: TESTPOINT; PCB Footprint: TP_40X65; Mfr_part_number: TP_40X65; Package: THRU-HOLE; Distributor_name: NA; Distributor_part_number: NA; Height: NA; Datasheet: NA; Crtd /date: SHREESHAIL/041005; Chkd/date: MAZHAR/271211
TP83 = TESTPOINT: as TP79 on sheet 41-SoC POWER SUPPLY; Footprint Ref: TP40_SMD; Library Ref: TESTPOINT; PCB Footprint: TP40_SMD; Mfr_part_number: TP40_SMD; Part_type: TESTPOINT; Package: SMD; Distributor_name: NA; Distributor_part_number: NA; Height: NA; Crtd /date: MAZHAR/190505; Chkd/date: MAZHAR/190505; Voltage: NA; Wattage: NA; Weight: NA; Temperature: NA; Datasheet: NA; MECHANICAL 3D STEP FILE: NA; Library Path: Y:\MIS_DATABASE\Library\ALTIUM_TOOL\SCHEMATICS_PARTS\MS_DISCRETE_Library.schlib; Footprint Path: Y:\MIS_DATABASE\Library\ALTIUM_TOOL\PCB_FOOTPRINTS\Altium_Footprint_Lib.PcbLib; RoHS: NA
TP84 = TESTPOINT: as TP3 on sheet 41-SoC POWER SUPPLY; Footprint Ref: TP40_SMD; Library Ref: TESTPOINT; PCB Footprint: TP40_SMD; Footprint Path: Y:\MIS_DATABASE\Library\ALTIUM_TOOL\PCB_FOOTPRINTS\Altium_Footprint_Lib.PcbLib; Library Path: Y:\MIS_DATABASE\Library\ALTIUM_TOOL\SCHEMATICS_PARTS\MS_DISCRETE_Library.schlib; Datasheet: NA; Temperature: NA; Weight: NA; Wattage: NA; Voltage: NA; Tolerance: NA; Chkd/date: MAZHAR/190505; Crtd /date: MAZHAR/190505; Height: NA; Distributor_part_number: NA; Distributor_name: NA; Package: SMD; Part_type: TESTPOINT; Mfr_part_number: TP40_SMD; RoHS: NA
U5 = TPS73501DRVR_SON6: IC 500mA LOW DROPOUT HIGH PSRR LINEAR REGULATOR SON6; Part_type: ICS\POWER\VOLTAGE REGULATOR; Mfr_name: TEXAS INSTRUMENTS; Mistral Part No: 142017110007-R; Custom_Duty: 15%; Customs_HS_Code: 85423100; Wattage: NA; Project: TI_MAXIE_CPB; Library Ref: TPS73501DRVR_SON6; MECHANICAL 3D STEP FILE: SON6_25-59_85X85_0-8; Chkd/date: MANIRAJA/161117; Crtd /date: MANIRAJA/161117; Datasheet: Y:\MIS_DATABASE\DATASHEETS\ICS\POWER\TPS735.PDF; Temperature: -40°C+125°C; Weight: 9.7mg; Height: 0.80MM; Distributor_part_number: 296-27480-1-ND; Distributor_name: DIGIKEY; Package: SON6; Voltage: NA; Tolerance: NA; Mfr_part_number: TPS73525DRVR; PCB Footprint: SON6_25-59_85X85_0-8
U10 = TPS51206DSQR_WSON10: IC SINK/SOURCE DDR TERMINATION REGULATOR WSON10; Mistral Part No: 142017090016-R; Mfr_name: TEXAS INSTRUMENTS; Part_type: ICS\POWER\VOLTAGE REGULATOR; Project: TI_MAXIE_CPB; Tolerance: NA; Customs_HS_Code: 85423100; Custom_Duty: 15%; Library Ref: TPS51206DSQR_WSON10; Mfr_part_number: TPS51206DSQR; Voltage: NA; Wattage: NA; Package: WSON10; Distributor_name: DIGIKEY; Distributor_part_number: 296-28767-1-ND; Height: 0.80MM; Weight: NA; Temperature: -40°C+85°C; Datasheet: Y:\MIS_DATABASE\DATASHEETS\ICS\POWER\TPS51206.PDF; Crtd /date: MANIRAJA/220917; Chkd/date: MANIRAJA/220917; MECHANICAL 3D STEP FILE: DFN10_15-74_80X80_0-8; PCB Footprint: DFN10_15-74_80X80_0-8
U40 = TPS62097RWKT_VQFNHR11: IC 2A SYNCHRONOUS STEP DOWN CONVERTER WITH IDCS CONTROL VQFN-HR11; Mistral Part No: 142017090025-R; Mfr_name: TEXAS INSTRUMENTS; Part_type: ICS\POWER\CONVERTER; Project: TI_MAXIE_CPB; Tolerance: NA; Customs_HS_Code: 85423100; Custom_Duty: 15%; Library Ref: TPS62097RWKT_VQFNHR11; Mfr_part_number: TPS62097RWKT; Voltage: NA; Wattage: NA; Package: VQFN-HR11; Distributor_name: DIGIKEY; Distributor_part_number: 296-43330-1-ND; Height: 1.00MM; Weight: NA; Temperature: -40°C+125°C; Datasheet: Y:\MIS_DATABASE\DATASHEETS\ICS\POWER\TPS62097.PDF; Crtd /date: MANIRAJA/270917; Chkd/date: MANIRAJA/270917; MECHANICAL 3D STEP FILE: VQFNHR11_TPS62097_80X80_1; PCB Footprint: VQFNHR11_TPS62097_80X80_1
U64 = TPS62095RGTR_VQFN16: IC 4A STEP DOWN CONVERTER WITH DCS CONTROL VQFN16; Part_type: ICS\POWER\CONVERTER; Mfr_name: TEXAS INSTRUMENTS; Mistral Part No: 142017100001-R; Custom_Duty: 15%; Customs_HS_Code: 85423100; Wattage: NA; Project: TI_MAXIE_CPB; Library Ref: TPS62095RGTR_VQFN16; MECHANICAL 3D STEP FILE: QFN16_19-68_120X120_1; Chkd/date: MANIRAJA/031017; Crtd /date: MANIRAJA/031017; Datasheet: Y:\MIS_DATABASE\DATASHEETS\ICS\POWER\TPS62095.PDF; Temperature: -40°C+85°C; Weight: NA; Height: 1.00MM; Distributor_part_number: 296-40833-1-ND; Distributor_name: DIGIKEY; Package: VQFN16; Voltage: NA; Tolerance: NA; Mfr_part_number: TPS62095RGTR; PCB Footprint: QFN16_19-68_120X120_1
U80 = TPS54334DRCT_VSON10: IC 3A O/P CURRENT SYNCHRONOUS STEP DOWN VOLTAGE CONVERTER VSON10; Part_type: ICS\POWER\CONVERTER; Mfr_name: TEXAS INSTRUMENTS; Mistral Part No: 142017090024-R; Custom_Duty: 15%; Customs_HS_Code: 85423100; Wattage: NA; Project: TI_MAXIE_CPB; Library Ref: TPS54334DRCT_VSON10; MECHANICAL 3D STEP FILE: SON10_19-68_125X125_1; Chkd/date: MANIRAJA/270917; Crtd /date: MANIRAJA/270917; Datasheet: Y:\MIS_DATABASE\DATASHEETS\ICS\POWER\TPS54334.PDF; Temperature: -40°C+85°C; Weight: 30mg; Height: 1.00MM; Distributor_part_number: 296-42172-2-ND; Distributor_name: DIGIKEY; Package: VSON10; Voltage: NA; Tolerance: NA; Mfr_part_number: TPS54334DRCT; PCB Footprint: SON10_19-68_125X125_1